# EasyEDA Pro project ProPrj_VFD-CLOCK_2024-10-19.epro, board PCB2
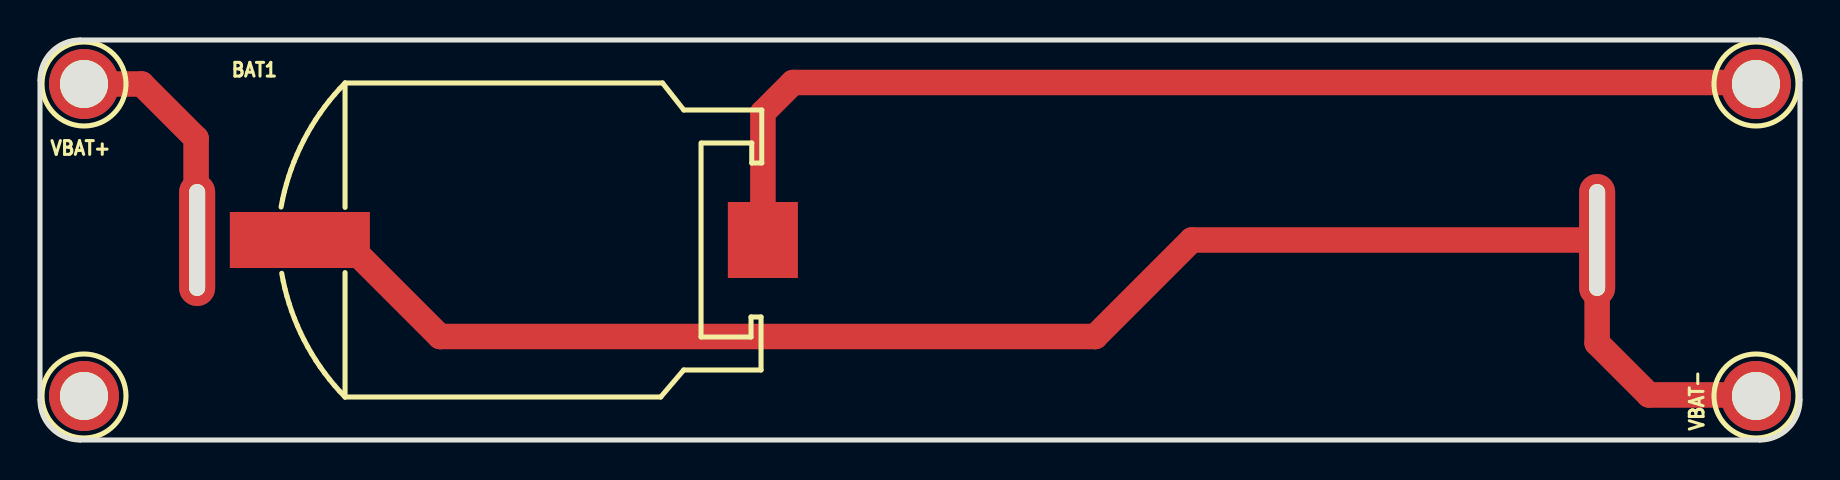
[diagram p4: board, top side]
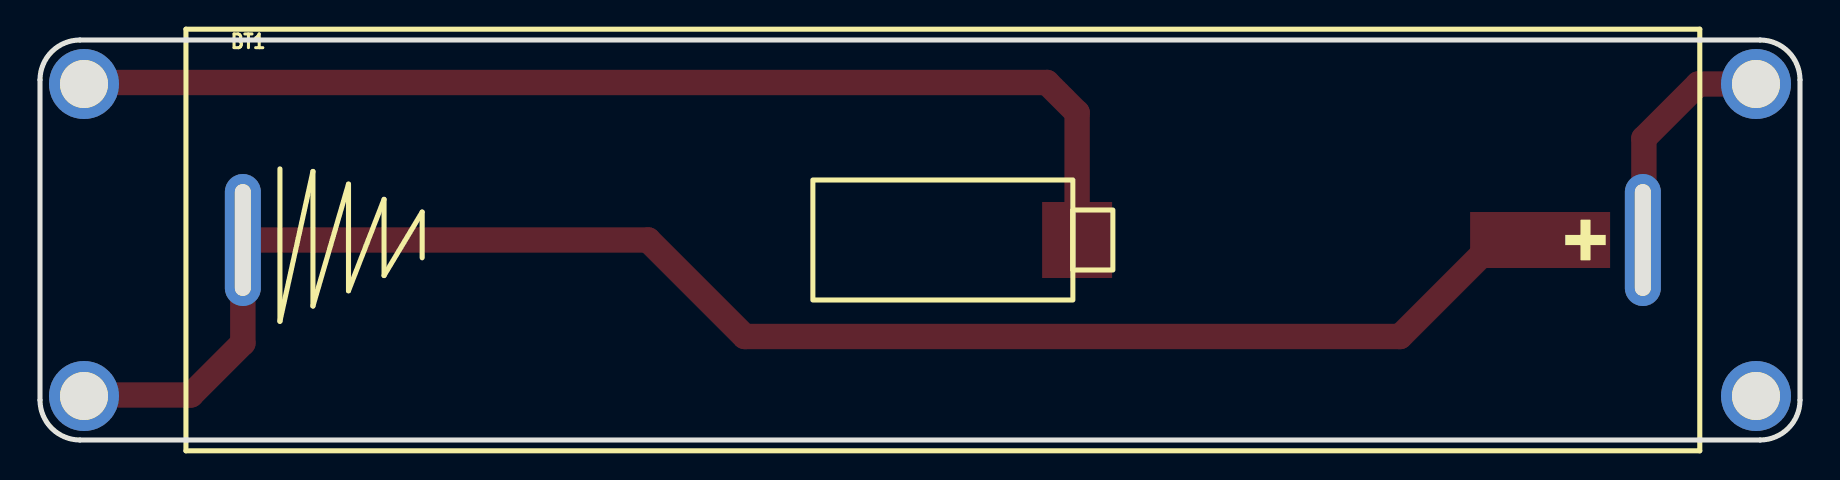
[diagram p5: board, bottom side, seen from below]

Outline 88 x 20 mm; copper layers: Top Layer, Bottom Layer. Coordinates in mm from the lower left corner of the outline.
Outline path: 0,18 0,2 arc(0.59,0.59) 2,0 86,0 arc(87.41,0.59) 88,2 88,18 arc(87.41,19.41) 86,20 2,20 arc(0.59,19.41) 0,18
Stack: Top Layer 0.035mm / Dielectric1 1.51mm FR4 er 4.5 / Bottom Layer 0.035mm

## Design rules (mm)
template: JLCPCB Capability(Two Layers Board)
spacing copperThickness1oz (default): track to track 0.102, other pairs 0.152 to 0.3
spacing copperThickness2oz: track to track 0.203, other pairs 0.152 to 0.3
track width copperThickness1oz (default): min 0.127, default 0.254, max 2.54
track width copperThickness2oz: min 0.203, default 0.254, max 2.54
differential pair differentialPair (default): width min 0.127, default 0.254, max 2.54; gap min 0.152, default 0.152
via viaSize (default): diameter min 0.5, default 0.61, max 10; hole min 0.3, default 0.305, max 6.3

## Placement (name value [footprint] x y rotation side)
BAT1  BS-CR2032-8  [BAT-SMD_BS-CR2032-8]  24.57 10 0 top
BT1  BH-18650-A1AJ006  [BAT-TH_BH-18650-A1AJ006]  42.86 10 180 bottom
U21  M2*10+3六角单通铜  [CONN-TH_C9900012092]  85.8 17.8 0 top
U22  M2*10+3六角单通铜  [CONN-TH_C9900012092]  2.2 2.2 0 top
VBAT+  M2*10+3六角单通铜  [CONN-TH_C9900012092]  2.2 17.8 0 top
VBAT-  M2*10+3六角单通铜  [CONN-TH_C9900012092]  85.8 2.2 0 top

## Footprints (pads in the part's own frame, mm; a bottom-side part is the same pattern mirrored in y, then rotated)
BAT-SMD_BS-CR2032-8
  rect 7x2.8 smd: 1(-11.575,0)
  rect 3.5x3.8 smd: 2(11.575,0)
BAT-TH_BH-18650-A1AJ006
  oval 1.8x6.6 hole 0.8x5.6: 1(-35,0) 2(35,0)
CONN-TH_C9900012092
  round 3.5 hole 2.4: 1(0,0)

## Nets
As in the schematic.

Pads without a net: U22 1

## Routing (per net, layer and track width the routed paths; a pad name or vN(x,y) marks a point on that pad's centre or on a via; arc(x,y) is an arc through that point)
GND: length 83.1
  Top Layer w1.27: 12.99,10.13 15.04,10.13 20,5.17 52.76,5.17 57.59,10 BT1.1 77.86,4.84 80.45,2.25 85.75,2.25 VBAT-.1
VBAT: length 11.8
  Top Layer w1.27: VBAT+.1 5.08,17.8 7.81,15.08 7.81,10.05 BT1.2
VBAT_LOW: length 56.6
  Top Layer w1.27: U21.1 85.73,17.87 37.65,17.87 36.14,16.37 36.14,10.13
